# EAGLE design PCB-OLEDROCKER (EAGLE 7.7.0)

## Sheet 1 of 2
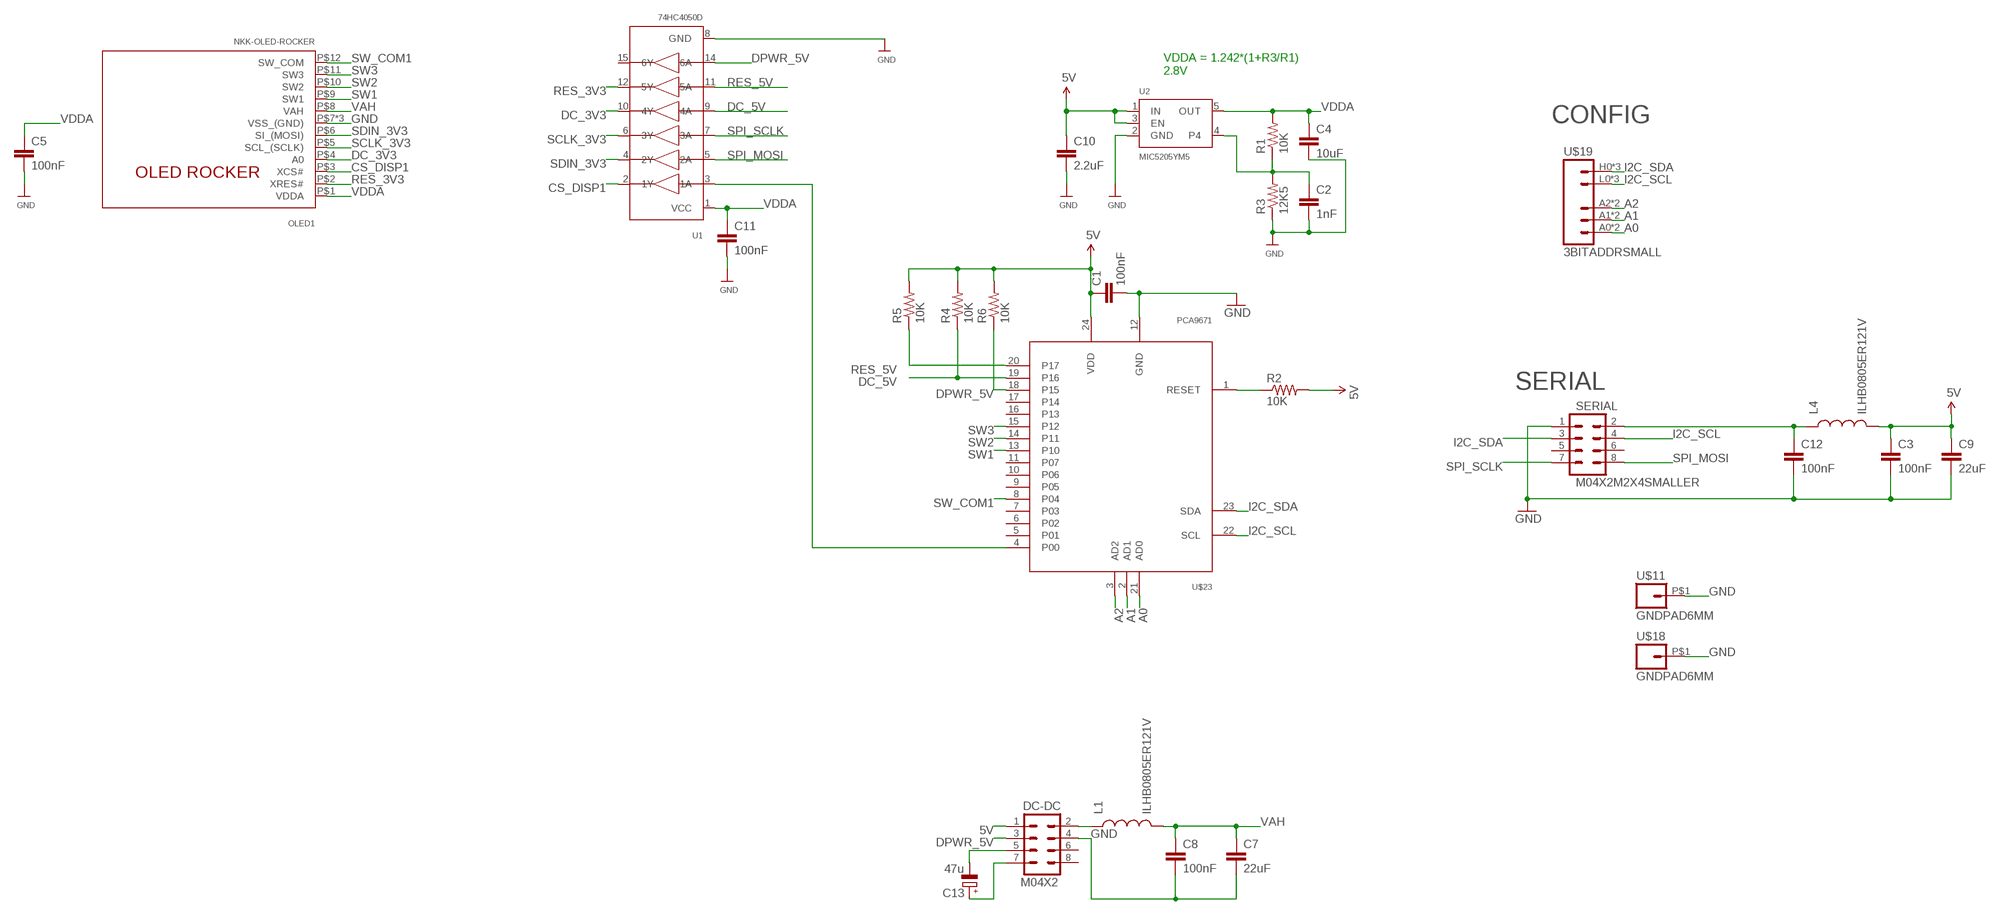
[diagram p0: schematic, sheet 1]

### Parts
C1  100nF  CAP0603-CAP  [0603-CAP]
C2  1nF  CAP0603-CAP  [0603-CAP]
C3  100nF  CAP0603-CAP  [0603-CAP]
C4  10uF  CAP0805  [0805]
C5  100nF  CAP0603-CAP  [0603-CAP]
C7  22uF  CAP0805  [0805]
C8  100nF  CAP0603-CAP  [0603-CAP]
C9  22uF  CAP0805  [0805]
C10  2.2uF  CAP0603-CAP  [0603-CAP]
C11  100nF  CAP0603-CAP  [0603-CAP]
C12  100nF  CAP0603-CAP  [0603-CAP]
C13  47u  CPOL-EUD  [PANASONIC_D]
DC-DC  M04X2  [2X4]
L1  ILHB0805ER121V  INDUCTOR0805  [0805]
L4  ILHB0805ER121V  INDUCTOR0805  [0805]
OLED1  NKK-OLED-ROCKER  [JST_BM12B-SURS]
R1  10K  RESISTOR0603-RES  [0603-RES]
R2  10K  RESISTOR0603-RES  [0603-RES]
R3  12K5  RESISTOR0603-RES  [0603-RES]
R4  10K  RESISTOR0603-RES  [0603-RES]
R5  10K  RESISTOR0603-RES  [0603-RES]
R6  10K  RESISTOR0603-RES  [0603-RES]
SERIAL  M04X2M2X4SMALLER  [M2X4SMALLER]
U1  74HC4050D  74HC4050DTSSOP16  [TSSOP16]
U2  MIC5205YM5  VREG_SOT23-5  [SOT23-5]
U$11  GNDPAD6MM  [3.2MMPAD6MM]
U$18  GNDPAD6MM  [3.2MMPAD6MM]
U$19  3BITADDRSMALL  [3BITADDR_SMALL]
U$23  PCA9671  [TSSOP24]

### Nets
5V [Power]: C1.1 C3.1 C9.1 C10.1 DC-DC.1 L4.2 R2.2 R4.2 R5.2 R6.2 U2.1(IN) U2.3(EN) U$23.24(VDD)
A0: U$19.A0 U$19.AS0(A0) U$23.21(AD0)
A1: U$19.A1 U$19.AS1(A1) U$23.2(AD1)
A2: U$19.A2 U$19.AS2(A2) U$23.3(AD2)
ARD_5V [Power]: C12.1 L4.1 SERIAL.2
ARD_5V1 [Power]: DC-DC.2 L1.1
CS_DISP1: OLED1.P$3(XCS#) U1.2(1Y)
DC_3V3: OLED1.P$4(A0) U1.10(4Y)
DC_5V: R4.1 U1.9(4A) U$23.19(P16)
DPWR_5V [Power]: DC-DC.3 R6.1 U1.14(6A) U$23.18(P15)
GND [Power]: C1.2 C2.2 C3.2 C4.2 C5.2 C7.2 C8.2 C9.2 C10.2 C11.2 C12.2 DC-DC.4 OLED1.P$7(VSS_(GND)) OLED1.SUPPORT1(VSS_(GND)) OLED1.SUPPORT2(VSS_(GND)) R3.1 SERIAL.1 U1.8(GND) U2.2(GND) U$11.P$1 U$18.P$1 U$23.12(GND)
I2C_SCL: SERIAL.4 U$19.L0(GND) U$19.L1(GND) U$19.L2(GND) U$23.22(SCL)
I2C_SDA: SERIAL.3 U$19.H0(VCC) U$19.H1(VCC) U$19.H2(VCC) U$23.23(SDA)
N$1: R2.1 U$23.1(RESET)
N$2: C13.- DC-DC.5
N$3: C2.1 R1.1 R3.2 U2.4
N$4: C13.+ DC-DC.7
N$29: U1.3(1A) U$23.4(P00)
RES_3V3: OLED1.P$2(XRES#) U1.12(5Y)
RES_5V: R5.1 U1.11(5A) U$23.20(P17)
SCLK_3V3: OLED1.P$5(SCL_(SCLK)) U1.6(3Y)
SDIN_3V3: OLED1.P$6(SI_(MOSI)) U1.4(2Y)
SPI_MOSI: SERIAL.8 U1.5(2A)
SPI_SCLK: SERIAL.7 U1.7(3A)
SW1: OLED1.P$9(SW1) U$23.13(P10)
SW2: OLED1.P$10(SW2) U$23.14(P11)
SW3: OLED1.P$11(SW3) U$23.15(P12)
SW_COM1 [Power]: OLED1.P$12(SW_COM) U$23.8(P04)
VAH [Power]: C7.1 C8.1 L1.2 OLED1.P$8(VAH)
VDDA: C4.1 C5.1 C11.1 OLED1.P$1(VDDA) R1.2 U1.1(VCC) U2.5(OUT)
Unconnected: DC-DC.6 DC-DC.8 SERIAL.5 SERIAL.6 U1.15(6Y) U$23.5(P01) U$23.6(P02) U$23.7(P03) U$23.9(P05) U$23.10(P06) U$23.11(P07) U$23.16(P13) U$23.17(P14)

### Notes on the sheet
- VDDA = 1.242*(1+R3/R1)
  2.8V
- CONFIG
- SERIAL

## Sheet 2 of 2

## Library data of the parts
C1-C5 C7-C12 = SparkFun:CAP: Capacitor Standard 0603 ceramic capacitor, and 0.1" leaded capacitor.
C13 = rcl:CPOL-EU: POLARIZED CAPACITOR, European symbol
DC-DC = SparkFun:M04X2
L1 L4 = SparkFun:INDUCTOR: Inductors Basic Inductor/Choke - 0603 and 1206. Footprints are not proven and vary greatly between part numbers.
OLED1 = SKAARHOJ:NKK-OLED-ROCKER
R1-R6 = SparkFun:RESISTOR: Resistor Basic schematic elements and footprints for 0603, 1206, and PTH resistors.
SERIAL = SKAARHOJ:M04X2
U1 = SKAARHOJ:74HC4050D: 6-channel level shifter 74HC4050D - 2V-6V Supply Digikey: 74HC4050D,653-ND Mouser: 771-74HC4050D-T
U2 = microbuilder:VREG_SOT23-5: SOT23-5 Fixed Voltage Regulators To better organise some of the SOT23-5 fixed voltage regulators in this library, this new part was created. Part Current Out V Out V In V Dropout Digikey Part No. ADP121 150mA 3.3V 3.4-5.5V 0.09V @ 150mA ADP121-AUJZ33R7CT-ND ADP121 150mA 3.0V 3.1-5.5V 0.09V @ 150mA ADP121-AUJZ30R7CT-ND ADP122 300mA 3.3V 3.4-5.5V 0.085V @ 300mA ADP122AUJZ-3.3-R7CT-ND ADP1712 300mA 3.3V 3.5-5.5V 0.17V @ 300mA ADP1712AUJZ-3.3-R7TR-ND AP7311 (Low Cost) 150mA 3.3V 3.5-6V 0.15V @ 150mA AP7311-33WG-7DICT-ND LD39015M18R 150mA 1.8V 1.9V-5.5V 0.08V @ 100mA 497-6977-1-ND MCP1824T-3302E/OT 300mA 3.3V 3.5V-6V 0.2V @ 300mA MCP1824T-3302E/OTCT-ND MIC5205-2.5YM5 TR 150mA 2.5V 2.7-16V 0.165V @ 150mA 576-1257-2-ND MIC5205-3.0YM5 TR 150mA 3.0V 3.2V-16V 0.165V @ 150mA 576-1258-2-ND MIC5205-3.3YM5 TR 150mA 3.3V 3.5V-16V 0.165V @ 150mA 576-1259-2-ND TPS780330220 150mA 3.3V+2.2V 3.6-5.5V 250mV Max 296-23332-1-ND TDA3663/N1,135 100mA 3.3V 3.5-45V 0.18V @ 50mA 568-5343-1-ND
U$11 U$18 = SKAARHOJ:GNDPAD
U$19 = SKAARHOJ:3BITADDR
U$23 = SKAARHOJ:PCA9671

## Net classes
0 default: width 0.203 mm, drill 0.305 mm, clearance 0.203 mm
1 Power: width 0.305 mm, drill 0.406 mm, clearance 0.203 mm

## Board
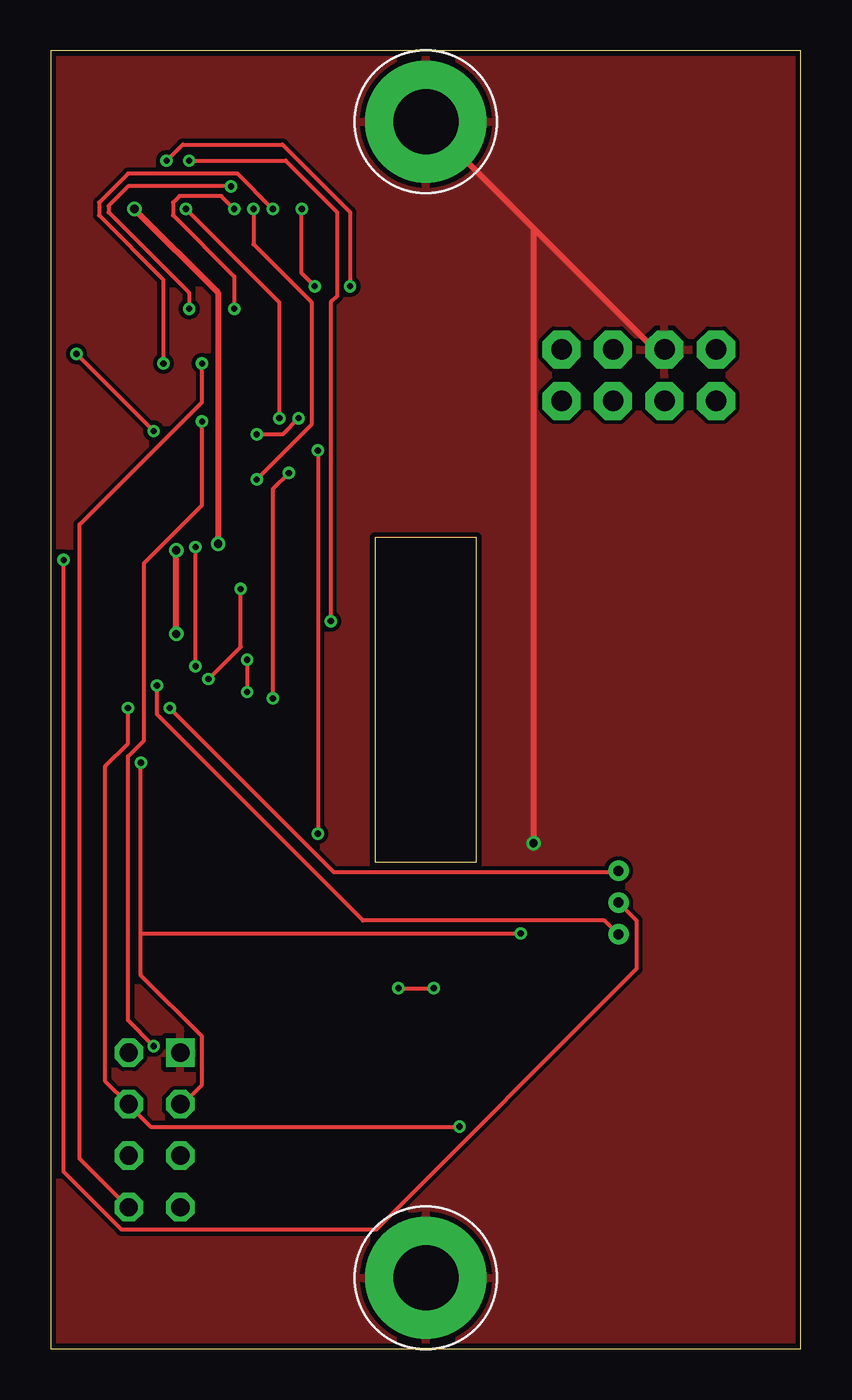
[diagram p1: board, top side]
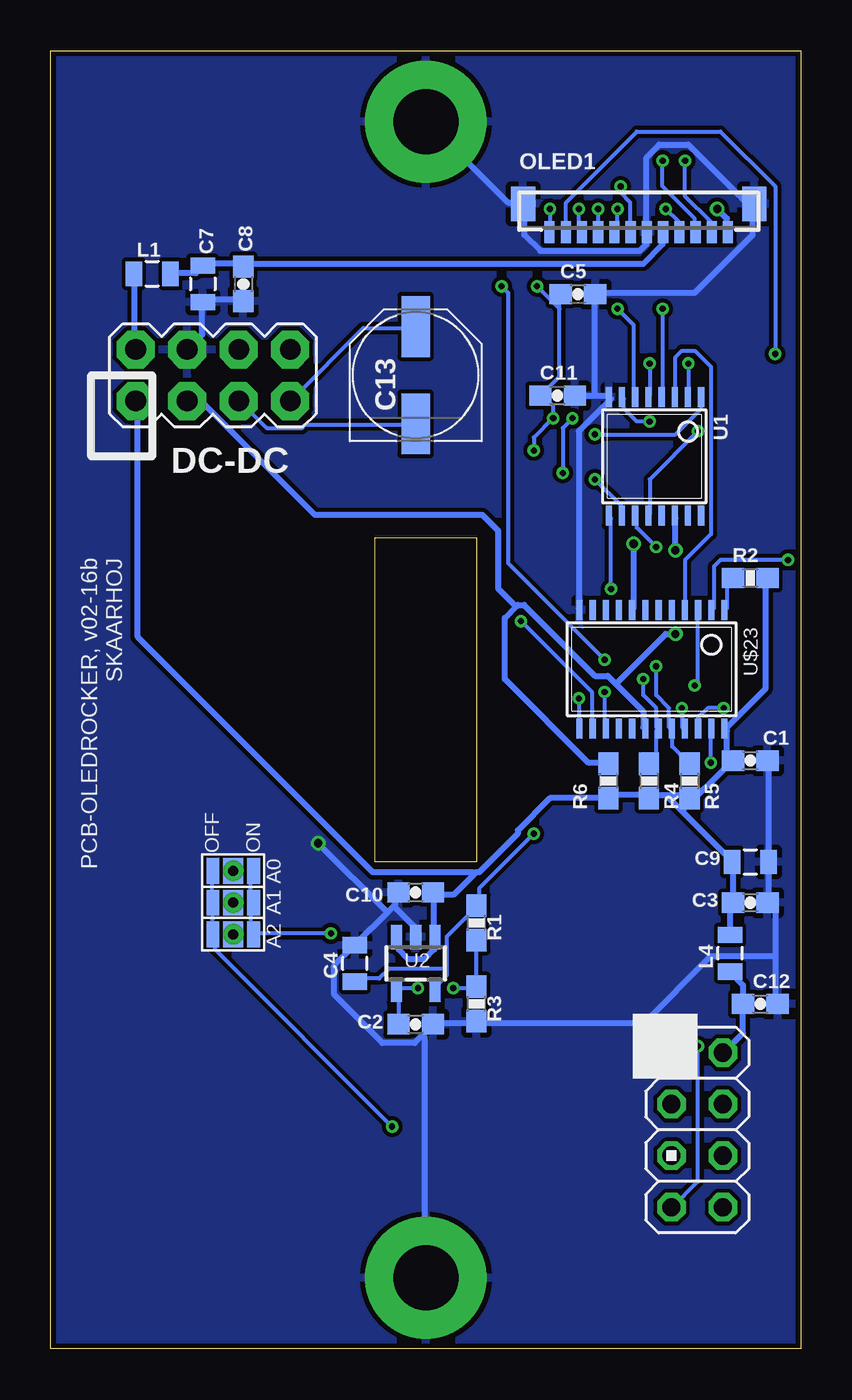
[diagram p2: board, bottom side, seen from below]

Size 37 x 64 mm. Coordinates in mm from the lower left corner, seen from the top.
Outline: 37,0 37,64 0,64 0,0 37,0
Outline: 16,24 21,24 21,40 16,40 16,24
Copper layers (1*16): Top 0.035mm / dielectric 1.5mm / Bottom 0.035mm
Design rules "Fusion_eagle_rule_v1.1": minimum track width 6mil, minimum drill 12mil, track to track 6mil, track to pad 6mil, pad to pad 6mil, via to via 6mil, smd to smd 0mil, copper to edge 10mil, drill to drill 10mil, minimum pad ring 10mil, minimum via ring 6mil, stop-mask expansion 2mil, vias tented up to drill 100mil, thermal gap 10mil

### Footprints (pad centres in the part's own frame; a part is rotated, then mirrored left to right if it is on the bottom)
0603-CAP = smd 1.1 x 1: 1 -0.85,0; 2 0.85,0
0805 = smd 0.8 x 1.2: 1 -0.9,0; 2 0.9,0
PANASONIC_D = smd 3 x 1.4: + 2.4,0; - -2.4,0
2X4 = drill 1.016 pad 1.88 octagon: 1 -3.81,-1.27; 2 -3.81,1.27; 3 -1.27,-1.27; 4 -1.27,1.27; 5 1.27,-1.27; 6 1.27,1.27; 7 3.81,-1.27; 8 3.81,1.27
JST_BM12B-SURS = smd 0.5 x 1.1: P$1 -4.4,-1.95; P$2 -3.6,-1.95; P$3 -2.8,-1.95; P$4 -2,-1.95; P$5 -1.2,-1.95; P$6 -0.4,-1.95; P$7 0.4,-1.95; P$8 1.2,-1.95; P$9 2,-1.95; P$10 2.8,-1.95; P$11 3.6,-1.95; P$12 4.4,-1.95 | smd 1.2 x 1.7: SUPPORT1 5.7,-0.55; SUPPORT2 -5.7,-0.55
0603-RES = smd 1.1 x 1: 1 -0.85,0; 2 0.85,0
M2X4SMALLER = drill 0.9 square: 1 -1.27,3.81 | drill 0.9 octagon: 2 1.27,3.81; 3 -1.27,1.27; 4 1.27,1.27; 5 -1.27,-1.27; 6 1.27,-1.27; 7 -1.27,-3.81; 8 1.27,-3.81
TSSOP16 = smd 0.305 x 0.991: 1 -3.575,-2.918; 2 -2.925,-2.918; 3 -2.275,-2.918; 4 -1.625,-2.918; 5 -0.975,-2.918; 6 -0.325,-2.918; 7 0.325,-2.918; 8 0.975,-2.918; 9 0.975,2.918; 10 0.325,2.918; 11 -0.325,2.918; 12 -0.975,2.918; 13 -1.625,2.918; 14 -2.275,2.918; 15 -2.925,2.918; 16 -3.575,2.918
SOT23-5 = smd 0.55 x 1.2: 1 -0.95,-1.3; 2 0,-1.3; 3 0.95,-1.3; 4 0.95,1.3; 5 -0.95,1.3
3.2MMPAD6MM = drill 3.2 pad 6: P$1 0,0
3BITADDR_SMALL = drill 0.5: A0 -1.565,0; A1 0,0; A2 1.565,0 | smd 1.27 x 1: AS0 -1.565,0; AS1 0,0; AS2 1.565,0 | smd 1.27 x 0.635: H0 -1.565,1; H1 0,1; H2 1.565,1; L0 -1.565,-1; L1 0,-1; L2 1.565,-1
TSSOP24 = smd 0.305 x 0.991: 1 -4.225,-2.918; 2 -3.575,-2.918; 3 -2.925,-2.918; 4 -2.275,-2.918; 5 -1.625,-2.918; 6 -0.975,-2.918; 7 -0.325,-2.918; 8 0.325,-2.918; 9 0.975,-2.918; 10 1.625,-2.918; 11 2.275,-2.918; 12 2.925,-2.918; 13 2.925,2.918; 14 2.275,2.918; 15 1.625,2.918; 16 0.975,2.918; 17 0.325,2.918; 18 -0.325,2.918; 19 -0.975,2.918; 20 -1.625,2.918; 21 -2.275,2.918; 22 -2.925,2.918; 23 -3.575,2.918; 24 -4.225,2.918

### Placement (x,y rotation side)
C1  2.5,29 0 bottom
C2  19,16 0 bottom
C3  2.5,22 0 bottom
C4  22,19 90 bottom
C5  11,52 0 bottom
C7  29.5,52.5 270 bottom
C8  27.5,52.5 270 bottom
C9  2.5,24 0 bottom
C10  19,22.5 180 bottom
C11  12,47 0 bottom
C12  2,17 0 bottom
C13  19,48 90 bottom
DC-DC  29,48 0 bottom
L1  32,53 0 bottom
L4  3.5,19.5 90 bottom
OLED1  8,57 0 bottom
R1  16,21 90 bottom
R2  2.5,38 0 bottom
R3  16,17 90 bottom
R4  7.5,28 270 bottom
R5  5.5,28 270 bottom
R6  9.5,28 270 bottom
SERIAL  5.12,10.79 0 bottom
U1  8.5,44 180 bottom
U2  19,19 180 bottom
U$11  18.5,60.5 0 top
U$18  18.5,3.5 0 top
U$19  28,22 270 bottom
U$23  8,33.5 180 bottom

### Tracks (layer width: path | path; a pad name or v marks a point on that pad's centre or on a via)
5V
  Bottom 0.305: R2.2 1.75,37.94 1.75,32.54 3.65,30.64 U$23.24 3.65,30.48 3.65,29.21 3.49,29.05 C1.1 3.49,28.89 5.87,26.51 | U2.3 19.84,20.16 19.84,19.68 19.37,19.21 18.57,19.21 18.1,19.68 18.1,20.16 U2.1 18.1,20.32 18.1,22.38 C10.1 17.94,22.38 17.14,22.38 16.11,23.42 | L4.2 3.49,20.48 3.49,21.91 C3.1 3.33,22.07 3.33,23.97 C9.1 3.49,24.13 5.87,26.51 | 6.67,27.3 7.46,27.3 R4.2 7.62,27.3 9.37,27.3 R6.2 9.53,27.15 12.38,27.15 13.97,25.56 13.97,25.4 15.88,23.5 16.03,23.5 16.11,23.42 | 6.67,27.3 5.56,27.3 R5.2 | 6.67,27.3 5.87,26.51 | DC-DC.1 32.7,46.67 32.7,35.08 21.11,23.5 16.19,23.5 16.11,23.42
A0  (via drill 0.3)
  Top 0.203: v5.87,31.59 13.97,23.5 27.94,23.5 U$19.AS0
  Bottom 0.203: v5.87,31.59 5.87,30.64 U$23.21 | 28.1,23.65 U$19.AS0
A1  (via drill 0.3)
  Top 0.203: v0.64,38.89 0.64,8.73 3.49,5.87 16.03,5.87 28.89,18.73 28.89,21.11 28.1,21.91 U$19.AS1
  Bottom 0.203: v0.64,38.89 3.97,38.89 4.29,38.58 4.29,36.51 U$23.2 | 28.1,22.07 U$19.AS1
A2  (via drill 0.3)
  Top 0.203: v5.24,32.7 5.24,31.27 15.4,21.11 27.3,21.11 27.94,20.48 U$19.AS2
  Bottom 0.203: v5.24,32.7 5.08,32.86 5.08,36.35 U$23.3 | 28.1,20.48 U$19.AS2
ARD_5V
  Bottom 0.305: L4.1 3.49,18.57 2.86,17.94 2.86,17.14 C12.1 2.86,16.99 2.86,15.56 3.81,14.61 SERIAL.2
ARD_5V1
  Bottom 0.305: L1.1 32.86,52.86 32.86,49.37 DC-DC.2
CS_DISP1  (via drill 0.3)
  Top 0.203: v5.56,48.58 5.56,52.7 2.38,55.88 2.38,56.52 3.81,57.94 9.21,57.94 v10.95,56.2
  Bottom 0.203: v5.56,48.58 5.56,46.99 U1.2 | v10.95,56.2 10.95,55.09 OLED1.P$3
DC_3V3  (via drill 0.3)
  Top 0.203: v10.16,42.86 12.86,45.56 12.86,51.59 10,54.45 v10,56.2
  Bottom 0.203: v10.16,42.86 8.89,41.59 8.89,41.12 U1.10 | v10,56.2 10,55.09 OLED1.P$4
DC_5V  (via drill 0.3)
  Top 0.203: v9.37,37.47 9.37,34.61 v7.78,33.02
  Bottom 0.203: R4.1 7.46,28.89 7.14,29.21 7.14,30.48 U$23.19 7.14,30.64 7.14,31.59 7.78,32.23 v7.78,33.02 | v9.37,37.47 9.37,40.96 U1.9
DPWR_5V  (via drill 0.41)
  Top 0.305: v6.19,35.24 v6.19,39.37
  Bottom 0.305: 9.13,32.78 9.53,33.18 10.16,33.18 13.65,36.67 13.97,36.67 14.05,36.59 | 9.13,32.78 7.78,31.43 7.78,30.64 U$23.18 | 14.05,36.59 14.61,36.04 14.61,33.02 10.48,28.89 9.53,28.89 R6.1 | v6.19,39.37 6.19,40.96 U1.14 | v6.19,35.24 6.67,35.24 9.13,32.78 | 14.05,36.59 14.92,37.47 14.92,40.32 15.72,41.12 23.97,41.12 29.53,46.67 30.16,46.67 DC-DC.3
GND  (via drill 0.41)
  Top 0.305: 23.89,55.17 18.57,60.48 U$11.P$1 | 23.89,55.17 29.69,49.37 30.16,49.37 DC-DC.4 | v23.81,24.92 23.81,55.09 23.89,55.17
  Bottom 0.305: C1.2 1.59,28.89 1.59,24.13 C9.2 1.59,23.97 1.59,22.07 C3.2 1.59,21.91 1.27,21.59 1.27,19.37 | 1.27,19.37 1.27,17.14 C12.2 | 20.4,21.51 21.91,20 C4.2 22.07,19.84 23.02,18.89 23.02,17.46 20.64,15.08 19.05,15.08 18.65,15.48 | 20.4,21.51 20.08,21.83 | 20.08,21.83 20,21.91 20,22.38 C10.2 | 20.08,21.83 19.05,20.8 19.05,20.32 U2.2 | 7.86,15.95 6.51,14.61 SERIAL.1 | 7.86,15.95 7.94,16.03 15.88,16.03 R3.1 16.03,16.03 18.1,16.03 C2.2 18.26,15.88 18.65,15.48 | 1.27,19.37 4.45,19.37 7.86,15.95 | U$18.P$1 18.57,3.65 18.57,15.4 18.65,15.48 | 10.16,46.99 11.11,46.99 C11.2 | 10.16,46.99 9.53,46.99 U1.8 9.37,46.83 10.95,45.24 10.95,36.51 U$23.12 | 10.16,46.99 10.16,51.91 C5.2 10,52.07 5.24,52.07 2.38,54.93 2.38,56.36 OLED1.SUPPORT1 2.38,56.52 2.7,56.52 5.56,59.37 6.99,59.37 7.62,58.74 7.62,55.09 OLED1.P$7 7.62,54.93 7.62,54.45 7.94,54.13 12.86,54.13 13.65,54.93 13.65,56.36 OLED1.SUPPORT2 13.81,56.52 14.45,56.52 18.41,60.48 U$11.P$1 | C8.2 27.62,51.75 29.37,51.75 C7.2 29.53,51.59 29.53,50.01 30.16,49.37 DC-DC.4 | v23.81,24.92 20.4,21.51
  pour Top: 0,0 37,0 37,64 0,64
  pour Bottom: 0,0 37,0 37,64 0,64
I2C_SCL  (via drill 0.3)
  Top 0.203: v3.81,31.59 3.81,29.84 2.7,28.73 2.7,13.18 3.81,12.06 SERIAL.4 3.97,11.91 4.92,10.95 v20.16,10.95
  Bottom 0.203: U$19.L0 29.05,23.5 29.05,22.07 U$19.L1 29.05,21.91 29.05,20.48 U$19.L2 28.89,20.32 28.89,19.68 v20.16,10.95 | v3.81,31.59 4.6,31.59 5.08,31.11 5.08,30.64 U$23.22
I2C_SDA  (via drill 0.3)
  Top 0.203: 4.45,20.48 4.45,18.41 7.46,15.4 7.46,13.02 6.51,12.06 SERIAL.3 | 4.45,20.48 v4.45,28.89 | 4.45,20.48 v23.18,20.48
  Bottom 0.203: U$19.H0 27.15,23.5 27.15,22.07 U$19.H1 27.15,21.91 27.15,20.48 U$19.H2 26.99,20.48 v23.18,20.48 | v4.45,28.89 4.45,30.48 U$23.23
N$1
  Bottom 0.203: U$23.1 3.65,36.51 3.65,37.78 3.49,37.94 R2.1
N$2
  Bottom 0.203: C13.- 19.05,45.56 24.45,45.56 24.61,45.4 26.35,45.4 27.62,46.67 DC-DC.5
N$3  (via drill 0.3)
  Top 0.203: v17.14,17.78 v18.89,17.78
  Bottom 0.203: C2.1 19.84,16.03 19.84,17.62 U2.4 19.84,17.78 v18.89,17.78 | R1.1 16.03,20 16.03,17.94 R3.2 16.03,17.78 v17.14,17.78
N$4
  Bottom 0.203: C13.+ 19.05,50.32 21.59,50.32 25.08,46.83 DC-DC.7
N$29
  Bottom 0.203: U$23.4 5.71,36.51 5.71,38.89 4.45,40.16 4.45,48.42 5.24,49.21 5.87,49.21 6.19,48.9 6.19,46.99 U1.3
RES_3V3  (via drill 0.3)
  Top 0.203: v1.27,49.05 v5.08,45.24
  Bottom 0.203: v5.08,45.24 7.46,42.86 7.46,41.12 U1.12 | v1.27,49.05 1.27,57.31 3.97,60.01 8.1,60.01 11.59,56.52 11.59,55.09 OLED1.P$2
RES_5V  (via drill 0.3)
  Top 0.203: v7.14,33.66 v7.14,39.53
  Bottom 0.203: R5.1 5.56,28.89 6.35,29.69 6.35,30.48 U$23.20 6.51,30.64 6.51,31.59 7.14,32.23 v7.14,33.66 | v7.14,39.53 8.1,40.48 8.1,40.96 U1.11
SCLK_3V3  (via drill 0.3)
  Top 0.203: v9.05,51.28 9.05,52.86 6.03,55.88 6.03,56.52 6.35,56.83 8.41,56.83 v9.05,56.2
  Bottom 0.203: v9.05,51.28 8.26,50.48 8.26,46.99 U1.6 | v9.05,56.2 9.05,55.09 OLED1.P$5
SDIN_3V3  (via drill 0.3)
  Top 0.203: v6.83,51.28 6.83,52.07 2.86,56.04 2.86,56.36 3.81,57.31 v8.89,57.31
  Bottom 0.203: v6.83,51.28 6.83,46.99 U1.4 | v8.89,57.31 8.89,56.99 8.41,56.52 8.41,55.09 OLED1.P$6
SPI_MOSI  (via drill 0.3)
  Top 0.203: v7.46,48.58 7.46,46.67 1.43,40.64 1.43,9.37 3.81,6.99 SERIAL.8
  Bottom 0.203: v7.46,48.58 7.46,46.99 U1.5
SPI_SCLK  (via drill 0.3)
  Top 0.203: v7.46,45.72 7.46,41.59 4.6,38.73 4.6,30 3.81,29.21 3.81,16.19 v5.08,14.92
  Bottom 0.203: v7.46,45.72 8.1,45.72 8.73,46.35 8.73,46.83 U1.7 | v5.08,14.92 5.08,8.26 6.35,6.99 SERIAL.7
SW1  (via drill 0.3)
  Top 0.203: v10.95,32.07 10.95,42.39 v11.75,43.18 | v11.27,45.88 11.27,51.59 v6.67,56.2
  Bottom 0.203: v10.95,32.07 10.95,30.64 U$23.13 | v11.75,43.18 11.75,45.4 v11.27,45.88 | v6.67,56.2 6.03,55.56 6.03,55.09 OLED1.P$9
SW2  (via drill 0.3)
  Top 0.203: v13.81,35.88 13.81,51.59 14.13,51.91 14.13,56.04 11.59,58.58 v6.83,58.58
  Bottom 0.203: v13.81,35.88 10.32,32.38 10.32,30.64 U$23.14 | v6.83,58.58 6.83,57.31 5.24,55.72 5.24,55.09 OLED1.P$10
SW3  (via drill 0.3)
  Top 0.203: v9.68,33.97 v9.68,32.38 | v14.76,52.39 14.76,56.04 11.43,59.37 6.51,59.37 v5.71,58.58
  Bottom 0.203: v9.68,32.38 9.68,30.64 U$23.15 | v9.68,33.97 14.45,38.73 14.45,52.07 v14.76,52.39 | v5.71,58.58 5.71,56.83 4.45,55.56 4.45,55.09 OLED1.P$11
SW_COM1  (via drill 0.41)
  Top 0.305: v8.26,39.69 8.26,52.07 v4.13,56.2
  Bottom 0.305: v8.26,39.69 8.26,36.51 U$23.8 | v4.13,56.2 3.65,55.72 3.65,55.09 OLED1.P$12
VAH
  Bottom 0.305: OLED1.P$8 6.83,54.93 6.83,54.45 7.78,53.5 27.46,53.5 C8.1 27.62,53.5 29.37,53.5 C7.1 29.53,53.34 29.84,53.02 30.96,53.02 L1.2
VDDA  (via drill 0.3)
  Top 0.203: v10.16,45.09 11.43,45.09 v12.22,45.88 | v12.38,56.2 12.38,53.02 v13.02,52.39 | v13.18,44.29 v13.18,25.4
  Bottom 0.203: 17.46,18.73 17.46,18.41 18.1,17.78 U2.5 | 17.46,18.73 17.46,20.32 16.03,21.75 R1.2 15.88,21.91 15.88,22.7 v13.18,25.4 | 17.46,18.73 20.32,18.73 20.8,18.26 21.91,18.26 C4.1 | v10.16,45.09 6.19,45.09 4.92,46.35 4.92,46.83 U1.1 | 11.91,51.28 11.91,47.94 12.7,47.15 C11.1 12.7,46.99 12.22,46.51 v12.22,45.88 13.18,44.93 v13.18,44.29 | 11.91,51.28 11.91,51.91 C5.1 | v12.38,56.2 12.38,55.09 OLED1.P$1 | 11.91,51.28 v13.02,52.39

### Text on the board
_bsilk: PCB-OLEDROCKER, v02-16b / SKAARHOJ